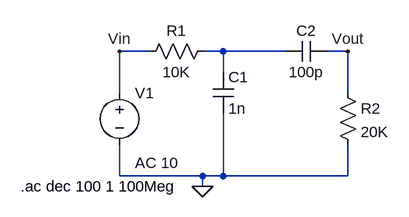
[diagram p0: schematic Band Pass Filter_ckt.asc]
Band Pass Filter_ckt.asc, the LTspice schematic file:
Version 4.1
SHEET 1 880 680
WIRE 80 128 32 128
WIRE 192 128 160 128
WIRE 288 128 192 128
WIRE 384 128 352 128
WIRE 192 160 192 128
WIRE 32 192 32 128
WIRE 384 192 384 128
WIRE 32 320 32 272
WIRE 160 320 32 320
WIRE 192 320 192 224
WIRE 192 320 160 320
WIRE 384 320 384 272
WIRE 384 320 192 320
WIRE 160 336 160 320
FLAG 160 336 0
FLAG 384 128 Vout
FLAG 32 128 Vin
SYMBOL res 176 112 R90
WINDOW 0 0 56 VBottom 2
WINDOW 3 32 56 VTop 2
SYMATTR InstName R1
SYMATTR Value 10K
SYMBOL cap 176 160 R0
SYMATTR InstName C1
SYMATTR Value 1n
SYMBOL cap 352 112 R90
WINDOW 0 0 32 VBottom 2
WINDOW 3 32 32 VTop 2
SYMATTR InstName C2
SYMATTR Value 100p
SYMBOL voltage 32 176 R0
WINDOW 123 24 124 Left 2
WINDOW 39 0 0 Left 0
SYMATTR InstName V1
SYMATTR Value ""
SYMATTR Value2 AC 10
SYMBOL res 368 176 R0
SYMATTR InstName R2
SYMATTR Value 20K
TEXT -120 336 Left 2 !.ac dec 100 1 100Meg

The netlist it stands for:
* Band Pass Filter_ckt.asc
R1 N001 Vin 10K
C1 N001 0 1n
C2 Vout N001 100p
V1 Vin 0 AC 10
R2 Vout 0 20K
.ac dec 100 1 100Meg
.backanno
.end